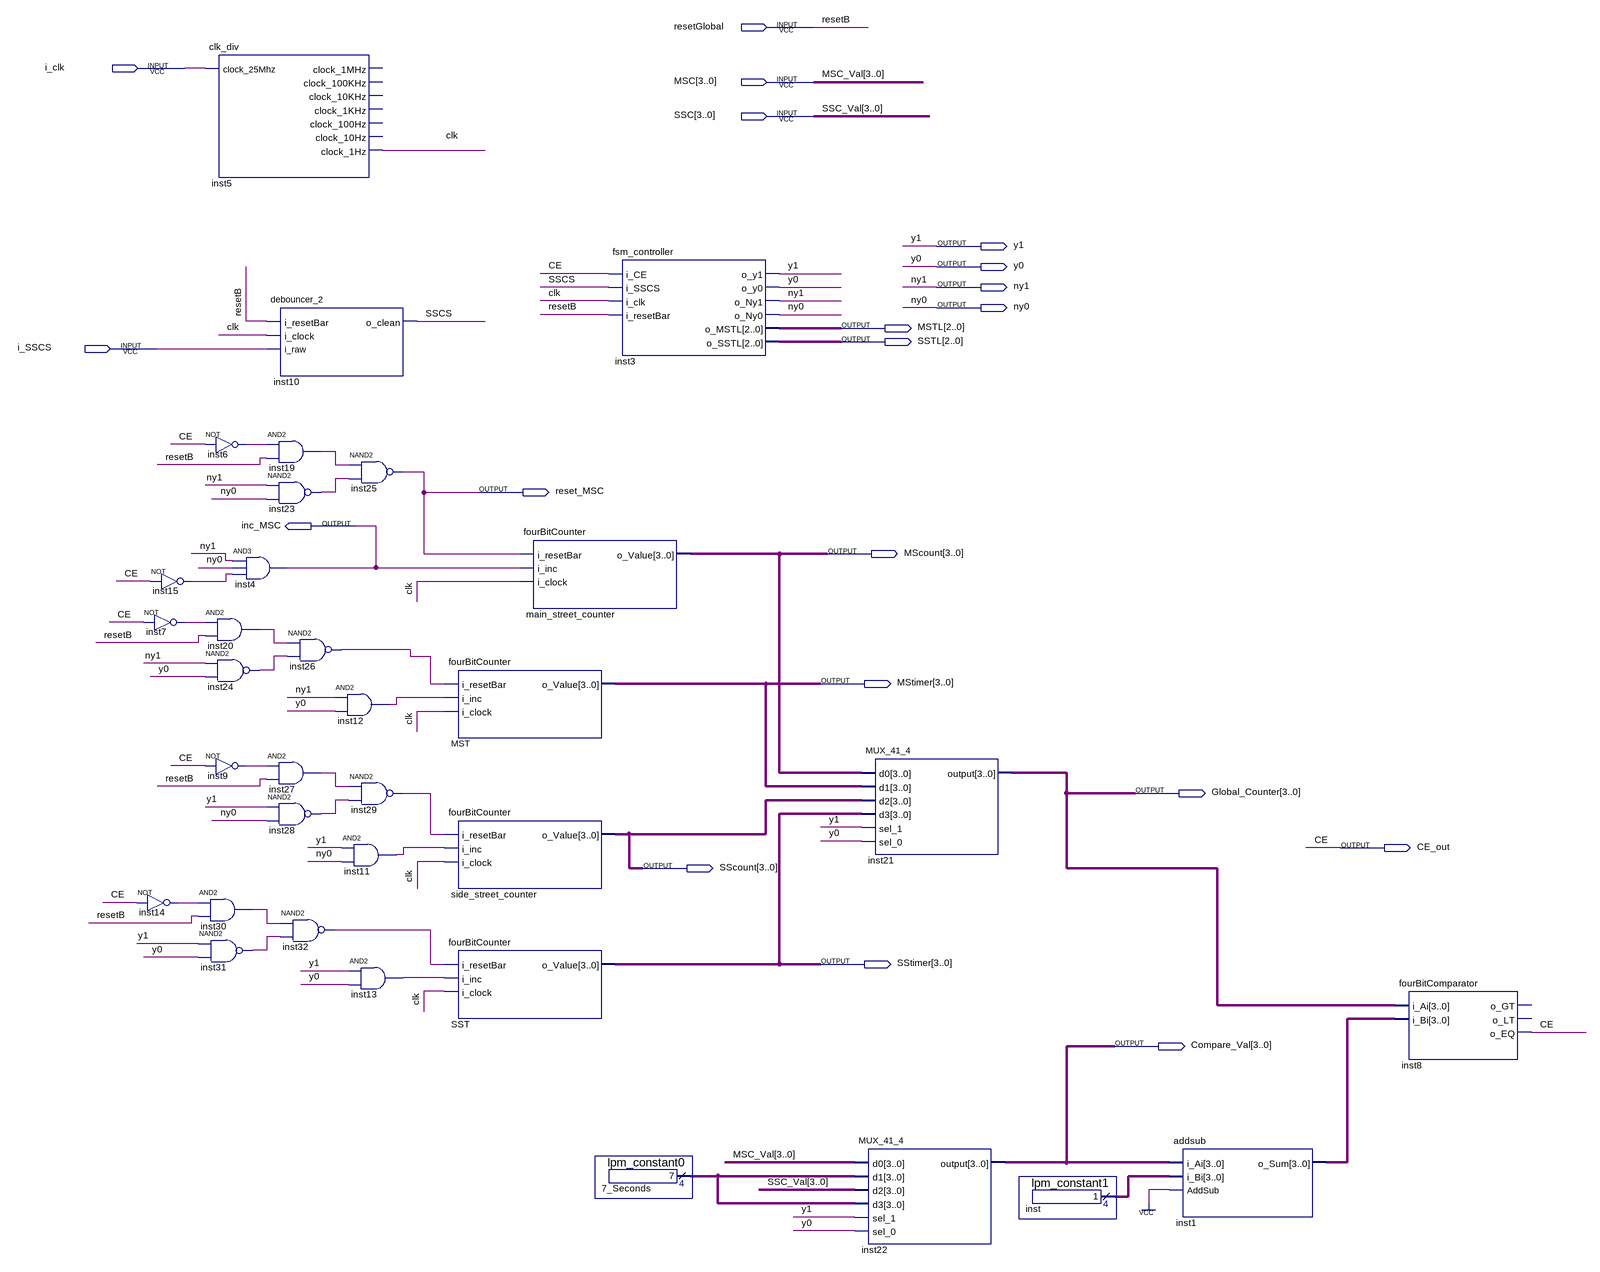
[diagram p0: schematic sheet]
// Quartus schematic Traffic_light_controller.bdf as structural Verilog: 34 symbols, 20 pins
module Traffic_light_controller (
  input  resetGlobal,
  input  i_clk,
  input  [3:0] MSC,
  input  [3:0] SSC,
  input  i_SSCS,
  output y1,
  output y0,
  output ny1,
  output ny0,
  output [2:0] MSTL,
  output [2:0] SSTL,
  output reset_MSC,
  output inc_MSC,
  output [3:0] MScount,
  output [3:0] MStimer,
  output [3:0] Global_Counter,
  output CE_out,
  output [3:0] SScount,
  output [3:0] SStimer,
  output [3:0] Compare_Val
);

  wire clk, inst6_out, inst7_out, inst9_out, inst11_out, inst12_out, inst13_out, inst14_out, inst15_out,
       inst19_out, inst20_out, inst23_out, inst24_out, inst26_out, inst27_out, inst28_out, inst29_out,
       inst30_out, inst31_out, inst32_out, SSCS;
  wire [3:0] inst1_o_sum, inst_result, n7_Seconds_result;

  not inst15 (inst15_out, CE_out);
  not inst7 (inst7_out, CE_out);
  not inst14 (inst14_out, CE_out);
  clk_div inst5 (
    .clock_25Mhz(i_clk), .clock_1Hz(clk));  // open: clock_1MHz, clock_100KHz, clock_10KHz, clock_1KHz, clock_100Hz, clock_10Hz
  not inst6 (inst6_out, CE_out);
  and inst20 (inst20_out, inst7_out, resetGlobal);
  nand inst24 (inst24_out, ny1, y0);
  not inst9 (inst9_out, CE_out);
  and inst30 (inst30_out, inst14_out, resetGlobal);
  nand inst31 (inst31_out, y1, y0);
  and inst4 (inc_MSC, ny1, ny0, inst15_out);
  debouncer_2 inst10 (.i_resetBar(resetGlobal), .i_clock(clk), .i_raw(i_SSCS), .o_clean(SSCS));
  and inst19 (inst19_out, inst6_out, resetGlobal);
  nand inst23 (inst23_out, ny1, ny0);
  nand inst26 (inst26_out, inst20_out, inst24_out);
  and inst27 (inst27_out, inst9_out, resetGlobal);
  nand inst28 (inst28_out, y1, ny0);
  nand inst32 (inst32_out, inst30_out, inst31_out);
  nand inst25 (reset_MSC, inst19_out, inst23_out);
  and inst12 (inst12_out, ny1, y0);
  nand inst29 (inst29_out, inst27_out, inst28_out);
  and inst11 (inst11_out, y1, ny0);
  and inst13 (inst13_out, y1, y0);
  fourBitCounter MST (.i_resetBar(inst26_out), .i_inc(inst12_out), .i_clock(clk), .o_Value(MStimer));
  fourBitCounter side_street_counter (.i_resetBar(inst29_out), .i_inc(inst11_out), .i_clock(clk), .o_Value(SScount));
  fourBitCounter SST (.i_resetBar(inst32_out), .i_inc(inst13_out), .i_clock(clk), .o_Value(SStimer));
  fourBitCounter main_street_counter (.i_resetBar(reset_MSC), .i_inc(inc_MSC), .i_clock(clk), .o_Value(MScount));
  fsm_controller inst3 (
    .i_CE(CE_out), .i_SSCS(SSCS), .i_clk(clk), .i_resetBar(resetGlobal), .o_y1(y1), .o_y0(y0), .o_Ny1(ny1),
    .o_Ny0(ny0), .o_MSTL(MSTL), .o_SSTL(SSTL));
  lpm_constant0 u_7_Seconds (.result(n7_Seconds_result));
  MUX_41_4 inst21 (
    .d0(MScount), .d1(MStimer), .d2(SScount), .d3(SStimer), .sel_1(y1), .sel_0(y0), .\output (Global_Counter));
  MUX_41_4 inst22 (
    .d0(MSC), .d1(n7_Seconds_result), .d2(SSC), .d3(n7_Seconds_result), .sel_1(y1), .sel_0(y0),
    .\output (Compare_Val));
  lpm_constant1 inst (.result(inst_result));
  addsub inst1 (.i_Ai(Compare_Val), .i_Bi(inst_result), .AddSub(1'b1), .o_Sum(inst1_o_sum));
  fourBitComparator inst8 (.i_Ai(Global_Counter), .i_Bi(inst1_o_sum), .o_EQ(CE_out));  // open: o_GT, o_LT

  // Other names for the same wires on the sheet: CE = CE_out; MSC_Val[3:0] = MSC; resetB = resetGlobal;
  //   SSC_Val[3:0] = SSC
endmodule
